# EAGLE schematic extensionboard (EAGLE 8.6.3)
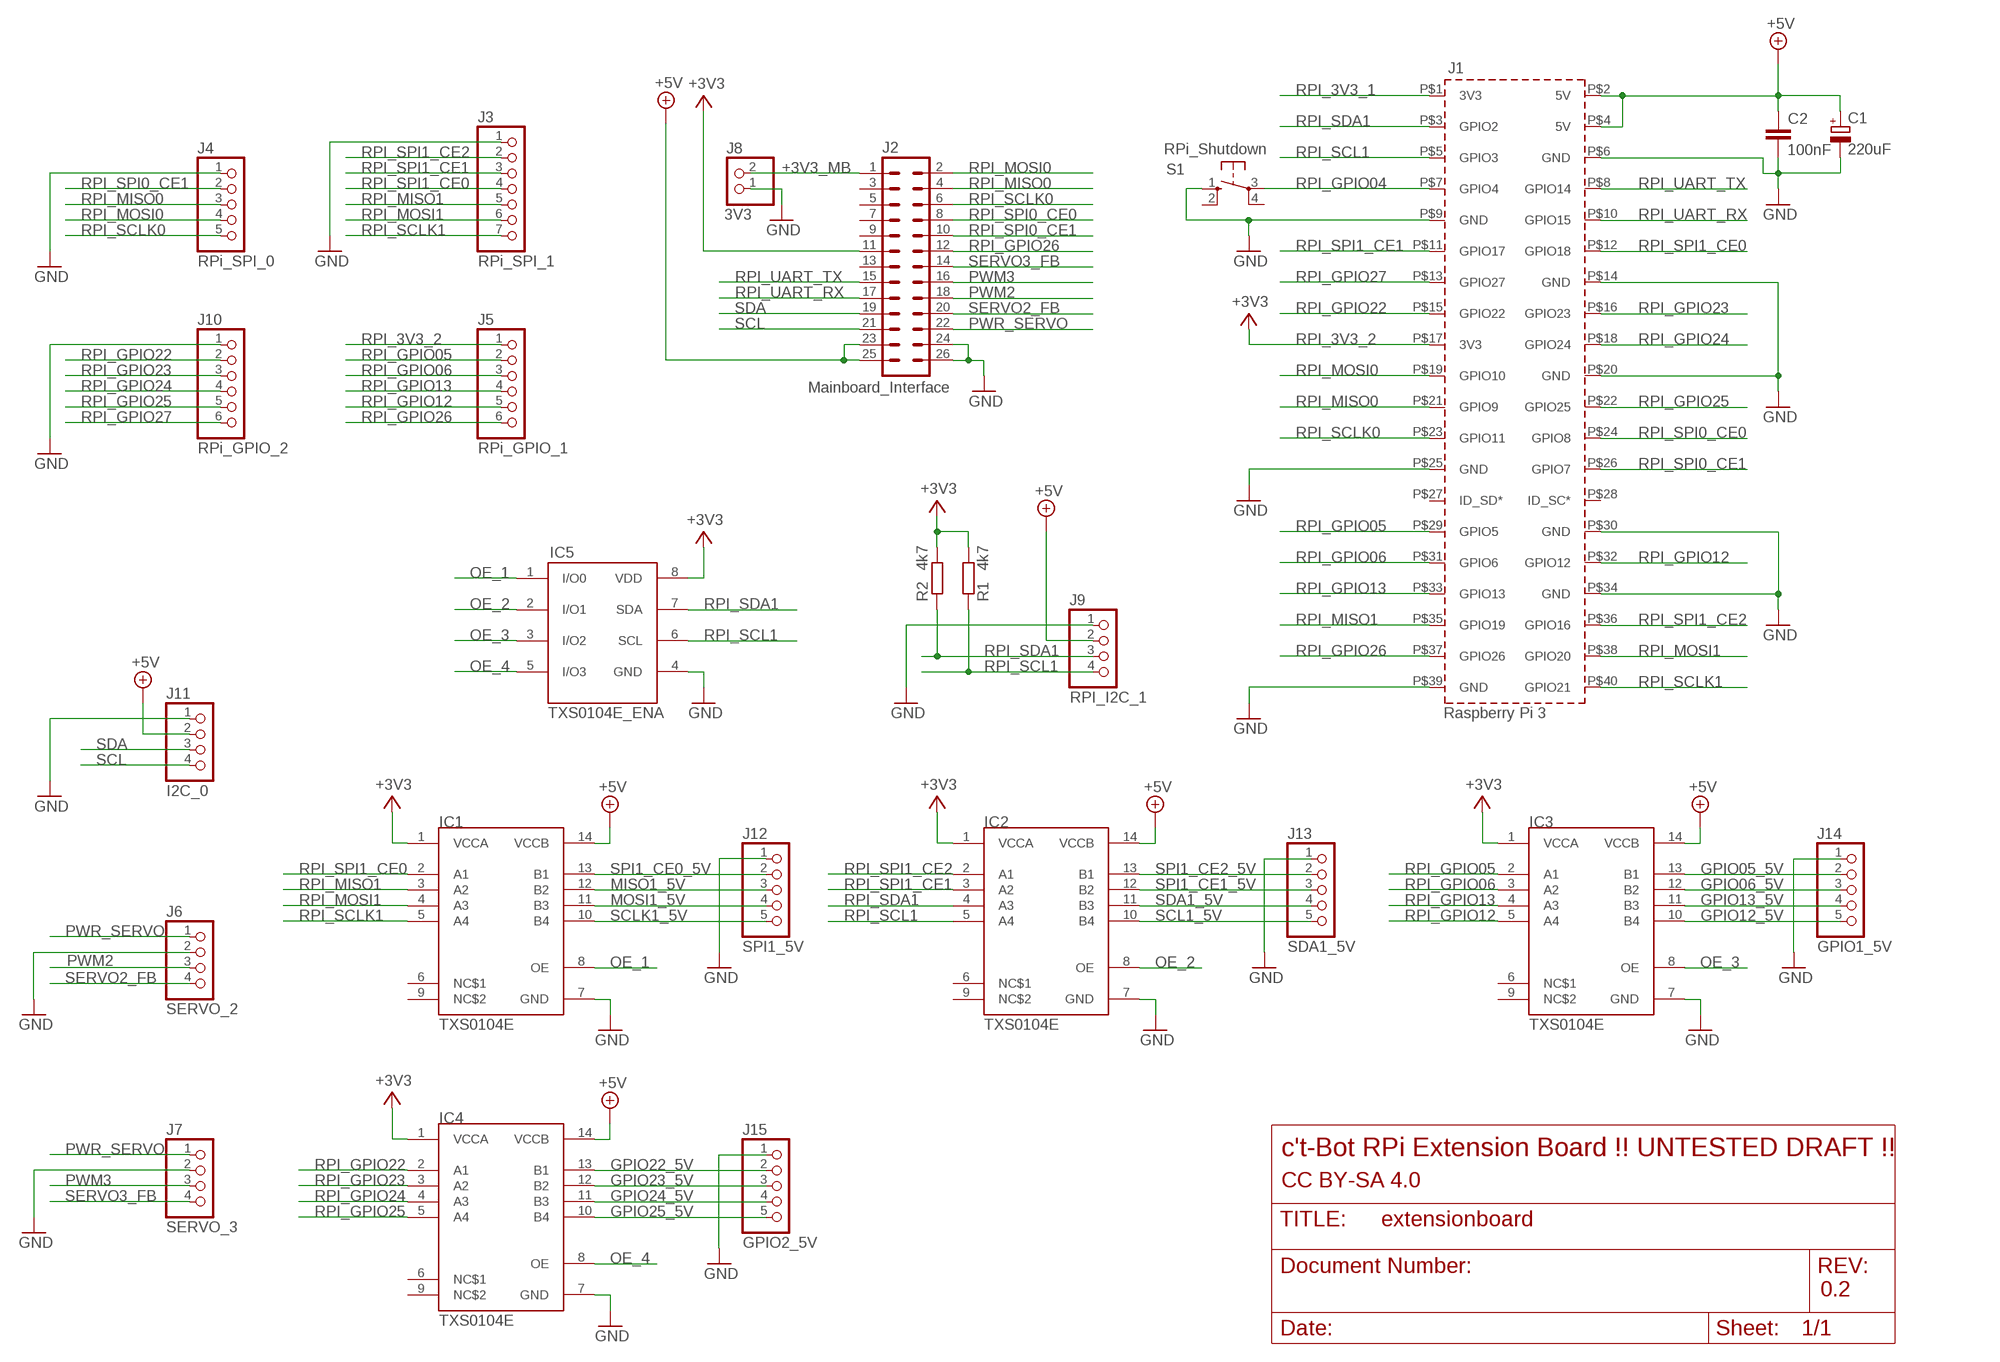
[diagram p0: schematic, sheet 1]

## Parts
C1  220uF  CPOL-EUE2.5-6  [E2,5-6]
C2  100nF  C-EU025-024X044  [C025-024X044]
IC1  TXS0104E  TXS0104ED  [SO14]
IC2  TXS0104E  TXS0104ED  [SO14]
IC3  TXS0104E  TXS0104ED  [SO14]
IC4  TXS0104E  TXS0104ED  [SO14]
IC5  TXS0104E_ENA  PCA9536D  [SOIC-8]
J1  Raspberry Pi 3  RPI3RPI3MIRROR  [RPI3MIRROR]
J2  Mainboard_Interface  ML26  [ML26]
J3  RPi_SPI_1  PINHD-1X7  [1X07]
J4  RPi_SPI_0  PINHD-1X5  [1X05]
J5  RPi_GPIO_1  PINHD-1X6  [1X06]
J6  SERVO_2  PINHD-1X4  [1X04]
J7  SERVO_3  PINHD-1X4  [1X04]
J8  3V3  PINHD-1X2  [1X02]
J9  RPI_I2C_1  PINHD-1X4  [1X04]
J10  RPi_GPIO_2  PINHD-1X6  [1X06]
J11  I2C_0  PINHD-1X4  [1X04]
J12  SPI1_5V  PINHD-1X5  [1X05]
J13  SDA1_5V  PINHD-1X5  [1X05]
J14  GPIO1_5V  PINHD-1X5  [1X05]
J15  GPIO2_5V  PINHD-1X5  [1X05]
R1  4k7  R-EU_0204/7  [0204/7]
R2  4k7  R-EU_0204/7  [0204/7]
S1  RPi_Shutdown  10-XX  [B3F-10XX]

## Nets
+3V3_MB: J2.1 J8.2
+5V: C1.+ C2.1 IC1.14(VCCB) IC2.14(VCCB) IC3.14(VCCB) IC4.14(VCCB) J1.P$2(5V) J1.P$4(5V) J2.23 J2.25 J9.2 J11.2
GND: C1.- C2.2 IC1.7(GND) IC2.7(GND) IC3.7(GND) IC4.7(GND) IC5.4(GND) J1.P$6(GND) J1.P$9(GND) J1.P$14(GND) J1.P$20(GND) J1.P$25(GND) J1.P$30(GND) J1.P$34(GND) J1.P$39(GND) J2.24 J2.26 J3.1 J4.1 J6.2 J7.2 J8.1 J9.1 J10.1 J11.1 J12.1 J13.1 J14.1 J15.1 S1.1(S)
GPIO05_5V: IC3.13(B1) J14.2
GPIO06_5V: IC3.12(B2) J14.3
GPIO12_5V: IC3.10(B4) J14.5
GPIO13_5V: IC3.11(B3) J14.4
GPIO22_5V: IC4.13(B1) J15.2
GPIO23_5V: IC4.12(B2) J15.3
GPIO24_5V: IC4.11(B3) J15.4
GPIO25_5V: IC4.10(B4) J15.5
MISO1_5V: IC1.12(B2) J12.3
MOSI1_5V: IC1.11(B3) J12.4
OE_1: IC1.8(OE) IC5.1(I/O0)
OE_2: IC2.8(OE) IC5.2(I/O1)
OE_3: IC3.8(OE) IC5.3(I/O2)
OE_4: IC4.8(OE) IC5.5(I/O3)
PWM2: J2.18 J6.3
PWM3: J2.16 J7.3
PWR_SERVO: J2.22 J6.1 J7.1
RPI_3V3_1: J1.P$1(3V3)
RPI_3V3_2: IC1.1(VCCA) IC2.1(VCCA) IC3.1(VCCA) IC4.1(VCCA) IC5.8(VDD) J1.P$17(3V3) J2.11 J5.1 R1.2 R2.2 ; supply symbol labelled +3V3
RPI_GPIO04: J1.P$7(GPIO4) S1.3(P)
RPI_GPIO05: IC3.2(A1) J1.P$29(GPIO5) J5.2
RPI_GPIO06: IC3.3(A2) J1.P$31(GPIO6) J5.3
RPI_GPIO12: IC3.5(A4) J1.P$32(GPIO12) J5.5
RPI_GPIO13: IC3.4(A3) J1.P$33(GPIO13) J5.4
RPI_GPIO22: IC4.2(A1) J1.P$15(GPIO22) J10.2
RPI_GPIO23: IC4.3(A2) J1.P$16(GPIO23) J10.3
RPI_GPIO24: IC4.4(A3) J1.P$18(GPIO24) J10.4
RPI_GPIO25: IC4.5(A4) J1.P$22(GPIO25) J10.5
RPI_GPIO26: J1.P$37(GPIO26) J2.12 J5.6
RPI_GPIO27: J1.P$13(GPIO27) J10.6
RPI_MISO0: J1.P$21(GPIO9) J2.4 J4.3
RPI_MISO1: IC1.3(A2) J1.P$35(GPIO19) J3.5
RPI_MOSI0: J1.P$19(GPIO10) J2.2 J4.4
RPI_MOSI1: IC1.4(A3) J1.P$38(GPIO20) J3.6
RPI_SCL1: IC2.5(A4) IC5.6(SCL) J1.P$5(GPIO3) J9.4 R1.1
RPI_SCLK0: J1.P$23(GPIO11) J2.6 J4.5
RPI_SCLK1: IC1.5(A4) J1.P$40(GPIO21) J3.7
RPI_SDA1: IC2.4(A3) IC5.7(SDA) J1.P$3(GPIO2) J9.3 R2.1
RPI_SPI0_CE0: J1.P$24(GPIO8) J2.8
RPI_SPI0_CE1: J1.P$26(GPIO7) J2.10 J4.2
RPI_SPI1_CE0: IC1.2(A1) J1.P$12(GPIO18) J3.4
RPI_SPI1_CE1: IC2.3(A2) J1.P$11(GPIO17) J3.3
RPI_SPI1_CE2: IC2.2(A1) J1.P$36(GPIO16) J3.2
RPI_UART_RX: J1.P$10(GPIO15) J2.17
RPI_UART_TX: J1.P$8(GPIO14) J2.15
SCL: J2.21 J11.4
SCL1_5V: IC2.10(B4) J13.5
SCLK1_5V: IC1.10(B4) J12.5
SDA: J2.19 J11.3
SDA1_5V: IC2.11(B3) J13.4
SERVO2_FB: J2.20 J6.4
SERVO3_FB: J2.14 J7.4
SPI1_CE0_5V: IC1.13(B1) J12.2
SPI1_CE1_5V: IC2.12(B2) J13.3
SPI1_CE2_5V: IC2.13(B1) J13.2
Unconnected: IC1.6(NC$1) IC1.9(NC$2) IC2.6(NC$1) IC2.9(NC$2) IC3.6(NC$1) IC3.9(NC$2) IC4.6(NC$1) IC4.9(NC$2) J1.P$27(ID_SD*) J1.P$28(ID_SC*) J2.3 J2.5 J2.7 J2.9 J2.13 S1.2(S1) S1.4(P1)

## Notes on the sheet
- c't-Bot RPi Extension Board !! UNTESTED DRAFT !!
- CC BY-SA 4.0
- 0.2

## Library data of the parts
C1 = rcl:CPOL-EU: POLARIZED CAPACITOR, European symbol; SPICEPREFIX: C
C2 = rcl:C-EU: CAPACITOR, European symbol; SPICEPREFIX: C
IC1-IC4 = mylib:TXS0104E: TXB0104
IC5 = PCA9536:PCA9536
J1 = e14_Rpi3_RevA+mirror-pcb:RPI3: Device for Raspberry Pi 3 board created by Dave Young for www.element14.com More information and support community is available at https://www.element14.com/community/community/raspberry-pi Device for Raspberry Pi 3 board updated by Gerald Schwarz for www.element14.com On RPI3 addet the layer milling and created a mirrored shield.
J2 = con-harting-ml:ML26: HARTING; OC_FARNELL: unknown; OC_NEWARK: unknown
J3 = pinhead_ts:PINHD-1X7: PIN HEADER
J4 J12-J15 = pinhead_ts:PINHD-1X5: PIN HEADER
J5 J10 = pinhead_ts:PINHD-1X6: PIN HEADER
J6 J7 J9 J11 = pinhead_ts:PINHD-1X4: PIN HEADER
J8 = pinhead_ts:PINHD-1X2: PIN HEADER
R1 R2 = rcl:R-EU_: RESISTOR, European symbol; SPICEPREFIX: R
S1 = switch-omron:10-XX: OMRON SWITCH; MPN: B3F-1000; OC_FARNELL: 176432; OC_NEWARK: 36M3542